# EAGLE design Ver.5 キッカー (EAGLE 9.6.2)

## Sheet 1 of 2
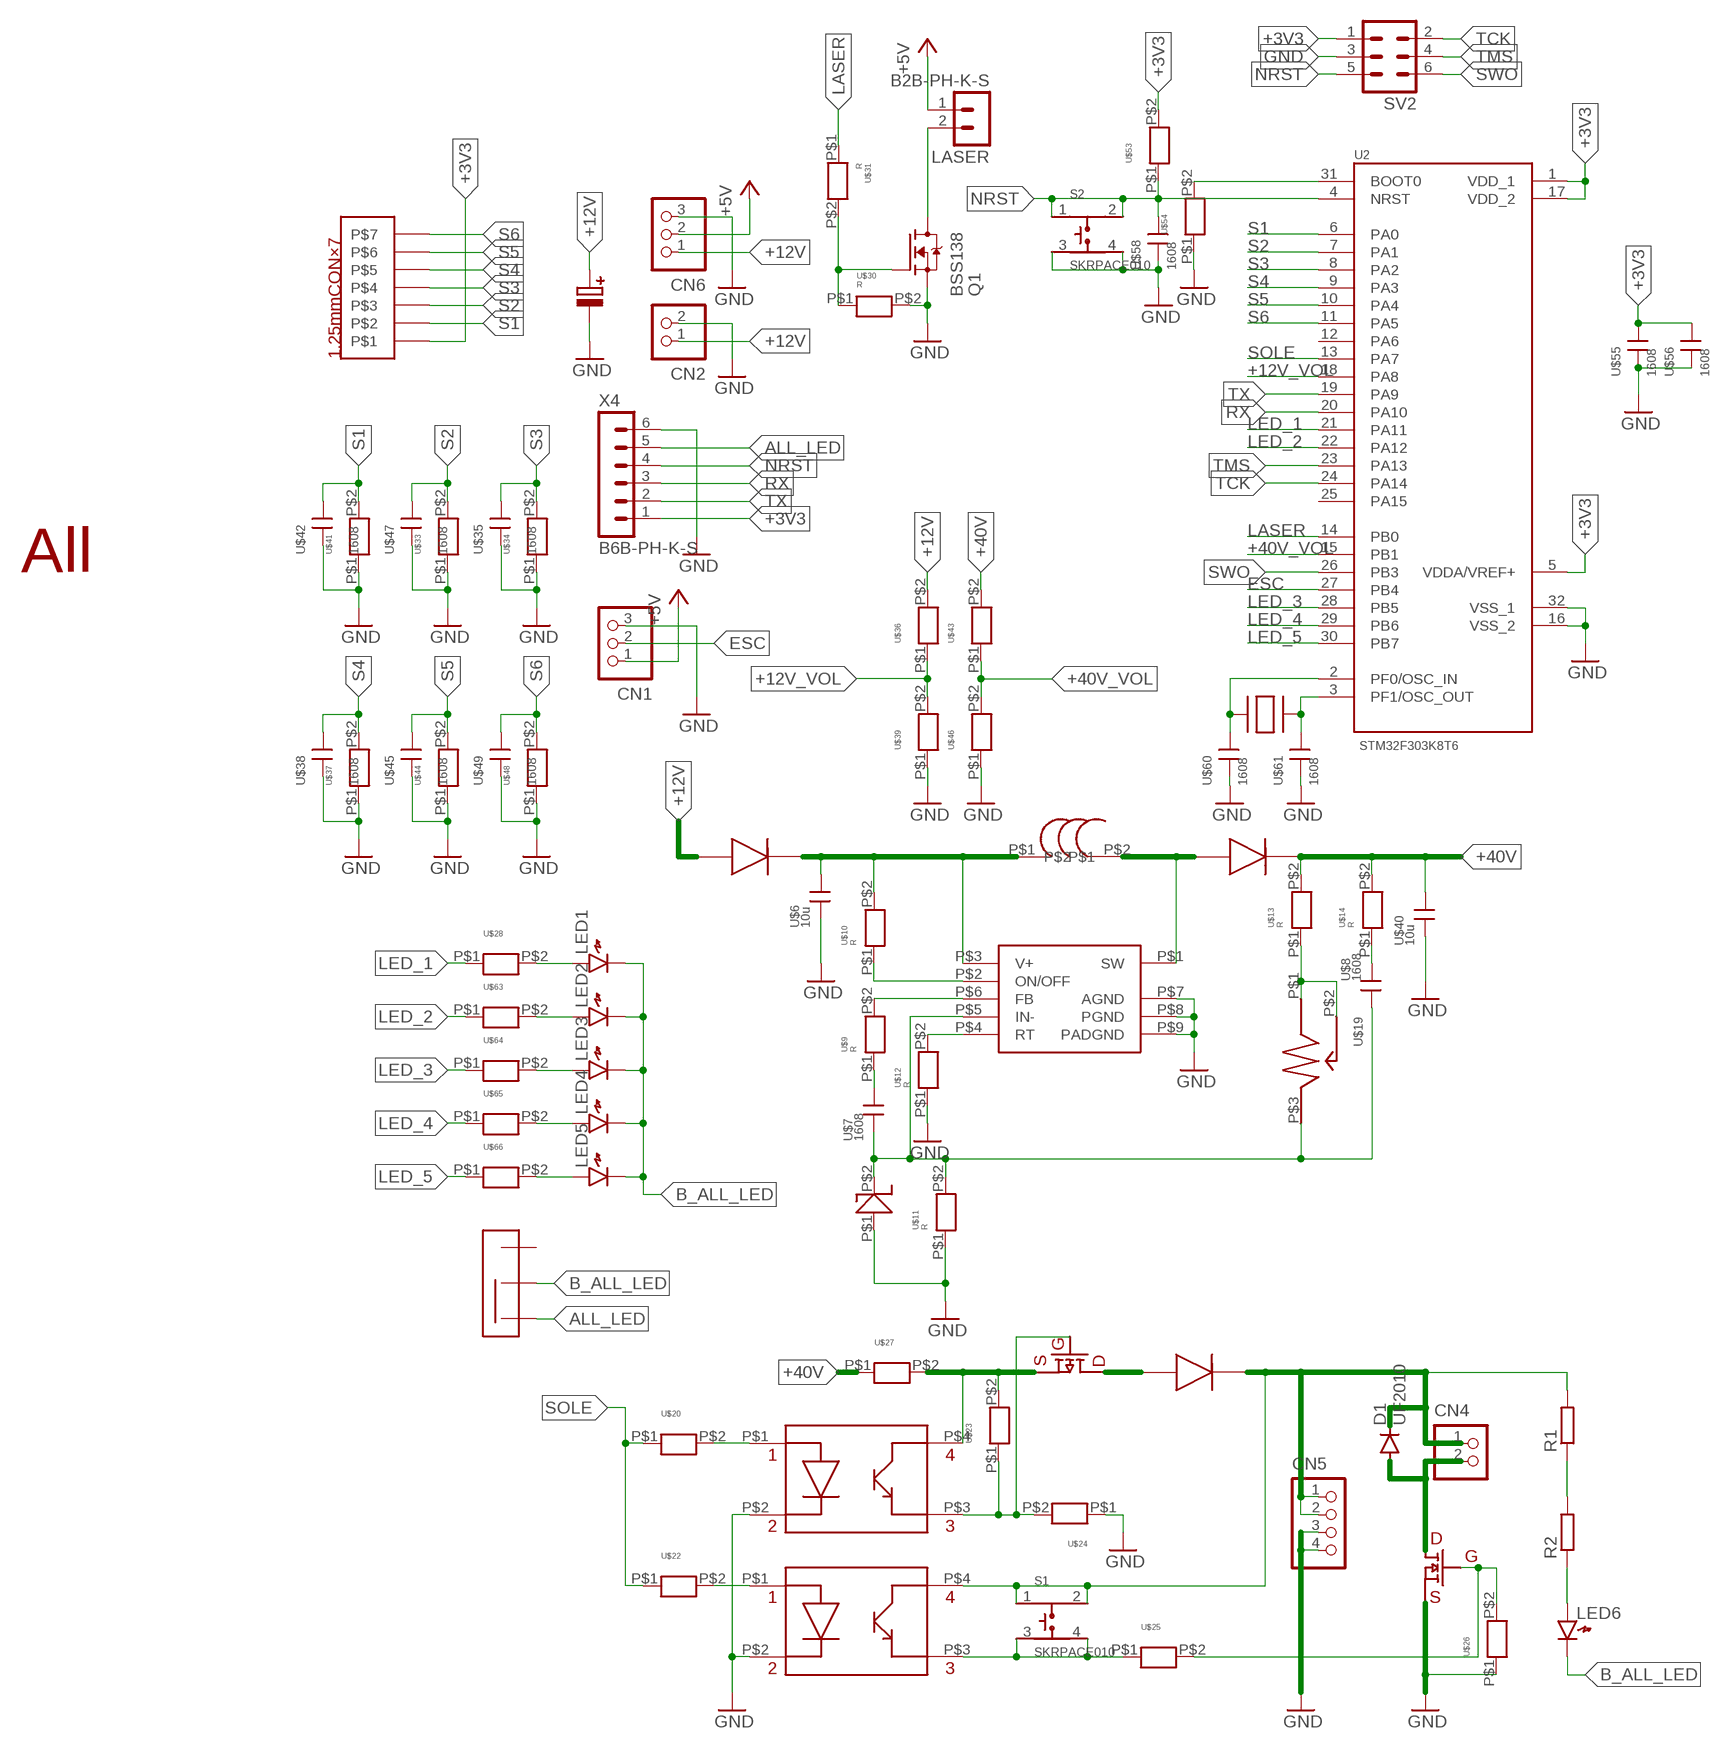
[diagram p0: schematic, sheet 1]

### Parts
CN1  B3B-XH-A  [B3B-XH-A]
CN2  B2B-XH-A  [B2B-XH-A]
CN4  B2B-XH-A  [B2B-XH-A]
CN5  B4B-XH-A  [B4B-XH-A]
CN6  B3B-XH-A  [B3B-XH-A]
D1  UF2010  1N4148DO35-10  [DO35-10]
LASER  B2B-PH-K-S  [B2B-PH-K-S]
LED1  LED1608  [LED1608]
LED2  LED1608  [LED1608]
LED3  LED1608  [LED1608]
LED4  LED1608  [LED1608]
LED5  LED1608  [LED1608]
LED6  LED1608  [LED1608]
Q1  BSS138  [SOT23]
R1  R-EU_0207/12  [0207/12]
R2  R-EU_0207/12  [0207/12]
S1  SKRPACE010  [SW_SKRPACE010]
S2  SKRPACE010  [SW_SKRPACE010]
SV2  ML6  [ML6]
U2  STM32F303K8T6  [QFP80P900X900X160-32N]
U$1  TD  [TD]
U$2  40V5A  [40V5A]
U$3  40V5A  [40V5A]
U$4  TLP291  [TPL291]
U$5  NJW4131GM1  [NJW4131]
U$6  10u  1608  [CON]
U$7  1608  [CON]
U$8  1608  [CON]
U$9  R  [1608]
U$10  R  [1608]
U$11  R  [1608]
U$12  R  [1608]
U$13  R  [1608]
U$14  R  [1608]
U$15  TLP291  [TPL291]
U$16  808  [808]
U$17  SSM6K8  [SSM6K8]
U$18  40V5A  [40V5A]
U$19  VR  [VR]
U$20  R  [1608]
U$21  1MM7  [1MM7]
U$22  R  [1608]
U$23  R  [1608]
U$24  R  [1608]
U$25  R  [1608]
U$26  R  [1608]
U$27  R  [1608]
U$28  R  [1608]
U$29  ALL  [ALL]
U$30  R  [1608]
U$31  R  [1608]
U$33  R  [1608]
U$34  R  [1608]
U$35  1608  [CON]
U$36  R  [1608]
U$37  R  [1608]
U$38  1608  [CON]
U$39  R  [1608]
U$40  10u  1608  [CON]
U$41  R  [1608]
U$42  1608  [CON]
U$43  R  [1608]
U$44  R  [1608]
U$45  1608  [CON]
U$46  R  [1608]
U$47  1608  [CON]
U$48  R  [1608]
U$49  1608  [CON]
U$50  I  [I]
U$53  R  [1608]
U$54  R  [1608]
U$55  1608  [CON]
U$56  1608  [CON]
U$58  1608  [CON]
U$59  SUISYOU  [水晶]
U$60  1608  [CON]
U$61  1608  [CON]
U$62  25V100  [25V100]
U$63  R  [1608]
U$64  R  [1608]
U$65  R  [1608]
U$66  R  [1608]
U$67  SSW  [SSW]
X4  B6B-PH-K-S  [B6B-PH-K-S]

### Nets
+3V3 [New Class]: SV2.1 U2.1(VDD_1) U2.5(VDDA/VREF+) U2.17(VDD_2) U$21.P$1 U$53.P$2 U$55.P$1 U$56.P$1 X4.1
+5V [New Class]: CN1.1 CN6.2 LASER.1
+12V [New Class]: CN2.1 CN6.1 U$3.P$1 U$36.P$2 U$62.P$1
+12V_VOL: U2.18(PA8) U$36.P$1 U$39.P$2
+40V [New Class]: U$2.P$2 U$13.P$2 U$14.P$2 U$27.P$1 U$40.P$1 U$43.P$2
+40V_VOL: U2.15(PB1) U$43.P$1 U$46.P$2
ALL_LED [New Class]: U$67.P$1 X4.5
B_ALL_LED [New Class]: LED1.K LED2.K LED3.K LED4.K LED5.K LED6.K U$67.P$3
ESC: CN1.2 U2.27(PB4)
GND [New Class]: CN1.3 CN2.2 CN5.3 CN5.4 CN6.3 Q1.2(S) S2.3 S2.4 SV2.3 U2.16(VSS_2) U2.32(VSS_1) U$1.P$1 U$4.P$2 U$5.P$7(AGND) U$5.P$8(PGND) U$5.P$9(PADGND) U$6.P$2 U$11.P$1 U$12.P$1 U$15.P$2 U$17.S U$24.P$1 U$26.P$1 U$30.P$2 U$33.P$1 U$34.P$1 U$35.P$2 U$37.P$1 U$38.P$2 U$39.P$1 U$40.P$2 U$41.P$1 U$42.P$2 U$44.P$1 U$45.P$2 U$46.P$1 U$47.P$2 U$48.P$1 U$49.P$2 U$54.P$1 U$55.P$2 U$56.P$2 U$58.P$2 U$60.P$2 U$61.P$2 U$62.P$2 X4.6
LASER: U2.14(PB0) U$31.P$1
LED_1: U2.21(PA11) U$28.P$1
LED_2: U2.22(PA12) U$63.P$1
LED_3: U2.28(PB5) U$64.P$1
LED_4: U2.29(PB6) U$65.P$1
LED_5: U2.30(PB7) U$66.P$1
N$1: U$4.P$1 U$20.P$2
N$2: U$5.P$2(ON/OFF) U$10.P$1
N$3: U$1.P$2 U$5.P$5(IN-) U$7.P$2 U$8.P$2 U$11.P$2 U$19.P$3
N$4: U$8.P$1 U$14.P$1
N$5: U$3.P$2 U$5.P$3(V+) U$6.P$1 U$10.P$2 U$50.P$1
N$6: U$2.P$1 U$5.P$1(SW) U$50.P$2
N$7: U$5.P$6(FB) U$9.P$2
N$8: U$7.P$1 U$9.P$1
N$9: U$15.P$1 U$22.P$2
N$11: U$5.P$4(RT) U$12.P$2
N$12: LED6.A R2.1
N$13: U$4.P$4 U$16.S U$23.P$2 U$27.P$2
N$14: U$4.P$3 U$16.G U$23.P$1 U$24.P$2
N$15: S1.3 S1.4 U$15.P$3 U$25.P$1
N$16: U$17.G U$25.P$2 U$26.P$2
N$17: R1.1 R2.2
N$18: CN4.2 D1.A U$17.D U$17.DD(D) U$17.DDD(D) U$17.DDDD(D)
N$19: CN4.1 CN5.1 CN5.2 D1.C R1.2 S1.1 S1.2 U$15.P$4 U$18.P$2
N$20: U$16.D U$16.DD(D) U$16.DDD(D) U$16.DDDD(D) U$18.P$1
N$21: LASER.2 Q1.3(D)
N$22: Q1.1(G) U$30.P$1 U$31.P$2
N$23: LED2.A U$63.P$2
N$24: U$13.P$1 U$19.P$1 U$19.P$2
N$25: LED1.A U$28.P$2
N$28: LED3.A U$64.P$2
N$30: LED4.A U$65.P$2
N$32: LED5.A U$66.P$2
N$46: U2.31(BOOT0) U$54.P$2
N$47: U2.2(PF0/OSC_IN) U$59.P$1 U$60.P$1
N$48: U2.3(PF1/OSC_OUT) U$59.P$2 U$61.P$1
NRST: S2.1 S2.2 SV2.5 U2.4(NRST) U$53.P$1 U$58.P$1 X4.4
RX: U2.20(PA10) X4.3
S1: U2.6(PA0) U$21.P$2 U$41.P$2 U$42.P$1
S2: U2.7(PA1) U$21.P$3 U$33.P$2 U$47.P$1
S3: U2.8(PA2) U$21.P$4 U$34.P$2 U$35.P$1
S4: U2.9(PA3) U$21.P$5 U$37.P$2 U$38.P$1
S5: U2.10(PA4) U$21.P$6 U$44.P$2 U$45.P$1
S6: U2.11(PA5) U$21.P$7 U$48.P$2 U$49.P$1
SOLE: U2.13(PA7) U$20.P$1 U$22.P$1
SWO: SV2.6 U2.26(PB3)
TCK: SV2.2 U2.24(PA14)
TMS: SV2.4 U2.23(PA13)
TX: U2.19(PA9) X4.2
Unconnected: U2.12(PA6) U2.25(PA15) U$67.P$2

## Sheet 2 of 2
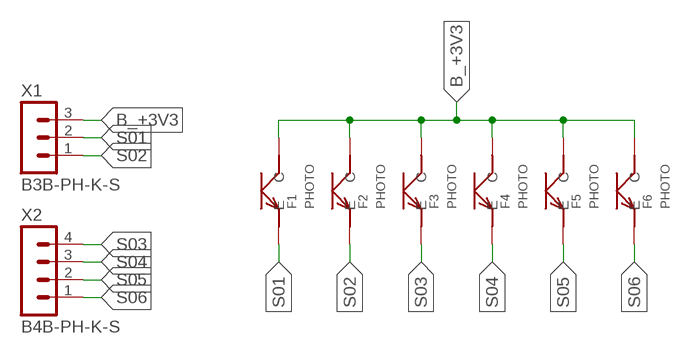
[diagram p1: schematic, sheet 2]

### Parts
F1  PHOTO  [PHOTO]
F2  PHOTO  [PHOTO]
F3  PHOTO  [PHOTO]
F4  PHOTO  [PHOTO]
F5  PHOTO  [PHOTO]
F6  PHOTO  [PHOTO]
X1  B3B-PH-K-S  [B3B-PH-K-S]
X2  B4B-PH-K-S  [B4B-PH-K-S]

### Nets
B_+3V3 [New Class]: F1.P$1(C) F2.P$1(C) F3.P$1(C) F4.P$1(C) F5.P$1(C) F6.P$1(C) X1.3
S01: F1.P$2(E) X1.2
S02: F2.P$2(E) X1.1
S03: F3.P$2(E) X2.4
S04: F4.P$2(E) X2.3
S05: F5.P$2(E) X2.2
S06: F6.P$2(E) X2.1

## Library data of the parts
CN1 CN6 = jst-xh:B3B-XH-A: Wire-to-Board 2.5mm pitch top mount connector Source: http://www.jst-mfg.com/product/pdf/jpn/XH.pdf http://www.jst-mfg.com/product/detail.php?series=277
CN2 CN4 = jst-xh:B2B-XH-A: Wire-to-Board 2.5mm pitch top mount connector Source: http://www.jst-mfg.com/product/pdf/jpn/XH.pdf http://www.jst-mfg.com/product/detail.php?series=277
CN5 = jst-xh:B4B-XH-A: Wire-to-Board 2.5mm pitch top mount connector Source: http://www.jst-mfg.com/product/pdf/jpn/XH.pdf http://www.jst-mfg.com/product/detail.php?series=277
D1 = diode:1N4148: DIODE high speed (Philips)
F1-F6 = Chip phototransistor:PHOTO
LASER = con-JST PH:B2B-PH: JST PH series header 2.00mm pitch disconnectable crimp style connectors, vertical (side entry type), 2 pins
LED1-LED6 = generic:LED: Generic LEDs
Q1 = bss138_10:BSS138: BSS138 N-Channel Logic Level Enhancement Mode Field Effect Transistor Source: http://www.fairchildsemi.com/datasheets/BS/BSS138.pdf; MF: Fairchild; MPN: BSS138; OC_FARNELL: 9845330; OC_NEWARK: 67R2009
R1 R2 = rcl:R-EU_: RESISTOR, European symbol; SPICEPREFIX: R
S1 S2 = SKRPACE010:SKRPACE010: Switch Tactile N.O. SPST Button J-Bend 0.05A 16VDC 2.55N SMD Automotive T/R Check prices <https://pricing.snapeda.com/parts/SKRPACE010/ALPS/view-part?ref=eda>; AVAILABILITY: In Stock; DESCRIPTION: Switch Tactile N.O. SPST Button J-Bend 0.05A 16VDC 2.55N SMD Automotive T/R; MF: ALPS; MP: SKRPACE010; PACKAGE: None; PRICE: None
SV2 = con-ml:ML6: HARTING; OC_FARNELL: unknown; OC_NEWARK: unknown
U2 = STM32F303K8T6:STM32F303K8T6: Analog and DSP with FPU ARM Cortex-M4 MCU with 64 Kbytes Flash, 72 MHz CPU, CCM, 12-bit ADC 5 MSPS, comparators, op-amp Check availability <https://pricing.snapeda.com/parts/STM32F303K8T6/STMicroelectronics/view-part?ref=eda>; AVAILABILITY: In Stock; DESCRIPTION: ARM® Cortex®-M4 STM32F3 Microcontroller IC 32-Bit 72MHz 64KB (64K x 8) FLASH 32-LQFP (7x7); MF: STMicroelectronics; MP: STM32F303K8T6; PACKAGE: LQFP-32 STMicroelectronics; PRICE: None; PURCHASE-URL: https://pricing.snapeda.com/search/part/STM32F303K8T6/?ref=eda
U$1 = ZD 3.9V200mW:TD
U$2 U$3 U$18 = D40V5A:40V5A
U$4 U$15 = TLP291:TLP291
U$5 = NJW4131GM1:NJW4131GM1
U$6-U$8 U$35 U$38 U$40 U$42 U$45 U$47 U$49 U$55 U$56 U$58 U$60 U$61 = con1608:1608
U$9-U$14 U$20 U$22-U$28 U$30 U$31 U$33 U$34 U$36 U$37 U$39 U$41 U$43 U$44 U$46 U$48 U$53 U$54 U$63-U$66 = R 1608:R
U$16 = PchMOSFET SSM6J808R:808
U$17 = NchMOSFET SSM6K819R:SSM6K8
U$19 = VR tippu:VR
U$21 = 7P_1.25mmCON:1MM7
U$29 = All_outlook:ALL
U$50 = Inductor_Read:I
U$59 = 水晶:SUISYOU
U$62 = 100uF25V 電解:25V100
U$67 = SSW:SSW
X1 = con-JST PH:B3B-PH: JST PH series header 2.00mm pitch disconnectable crimp style connectors, vertical (side entry type), 3 pins
X2 = con-JST PH:B4B-PH: JST PH series header 2.00mm pitch disconnectable crimp style connectors, vertical (side entry type), 4 pins
X4 = con-JST PH:B6B-PH: JST PH series header 2.00mm pitch disconnectable crimp style connectors, vertical (side entry type), 6 pins

## Net classes
1 New Class: width 0.254 mm

## Board
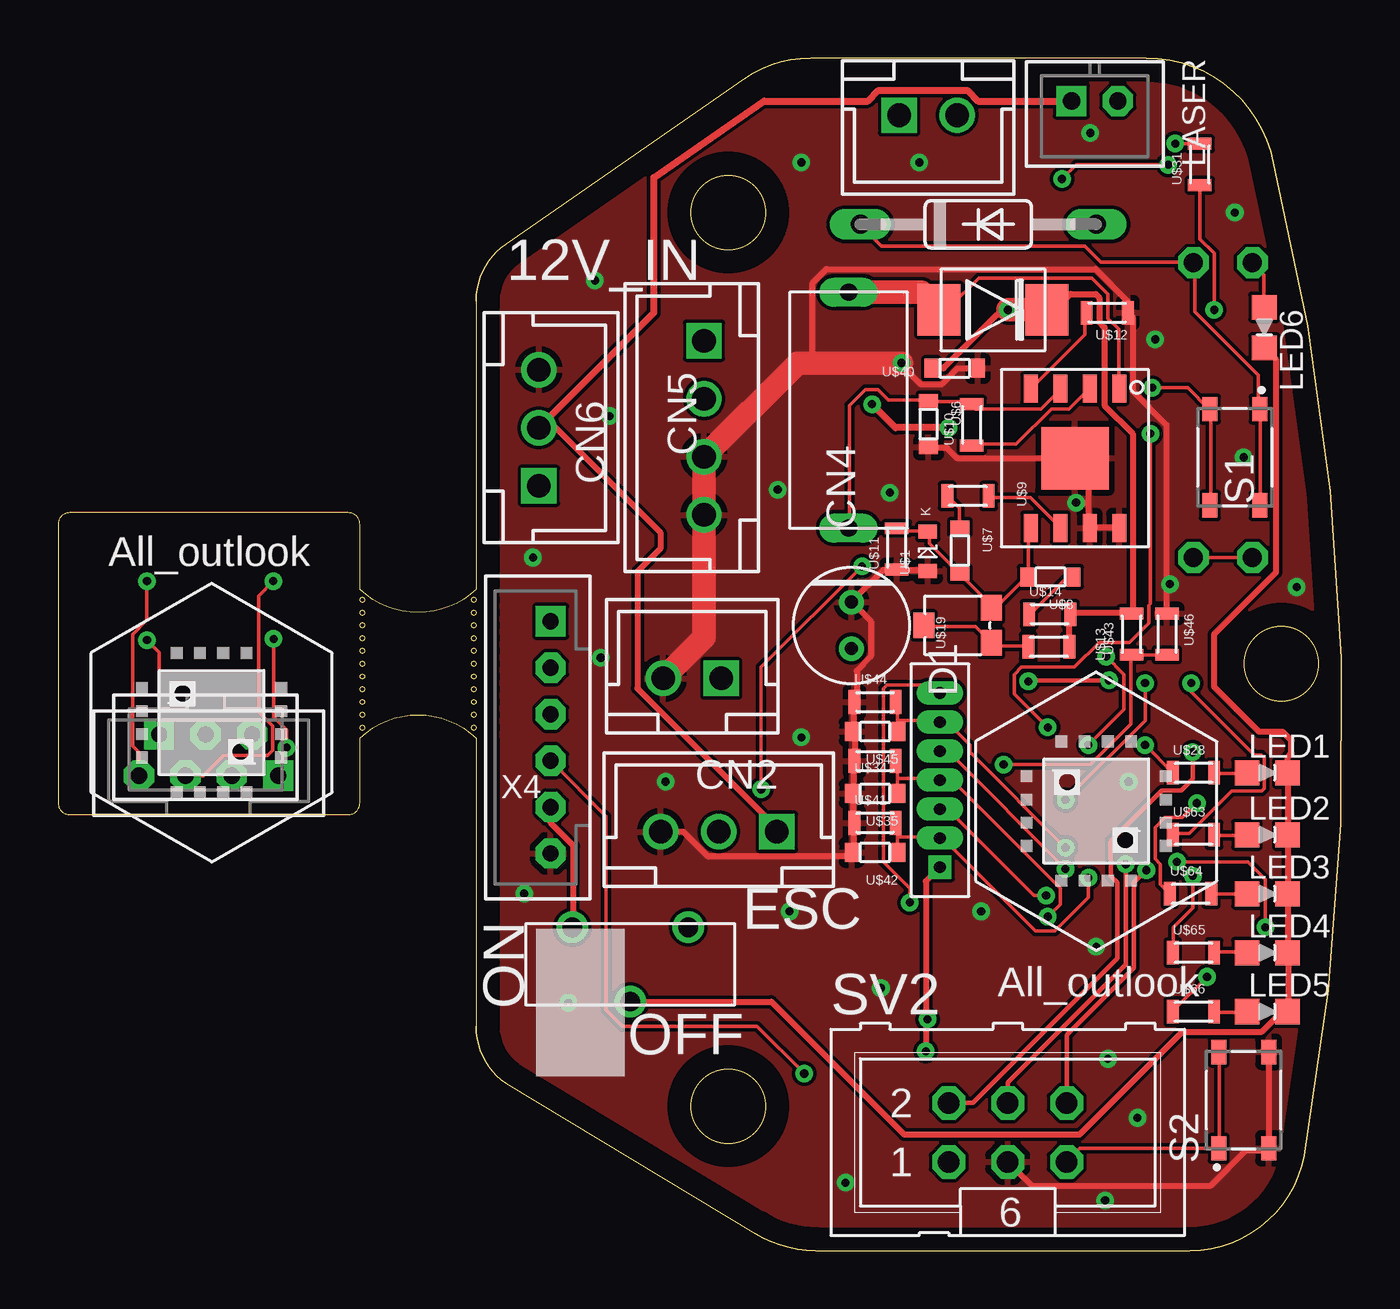
[diagram p2: board, top side]
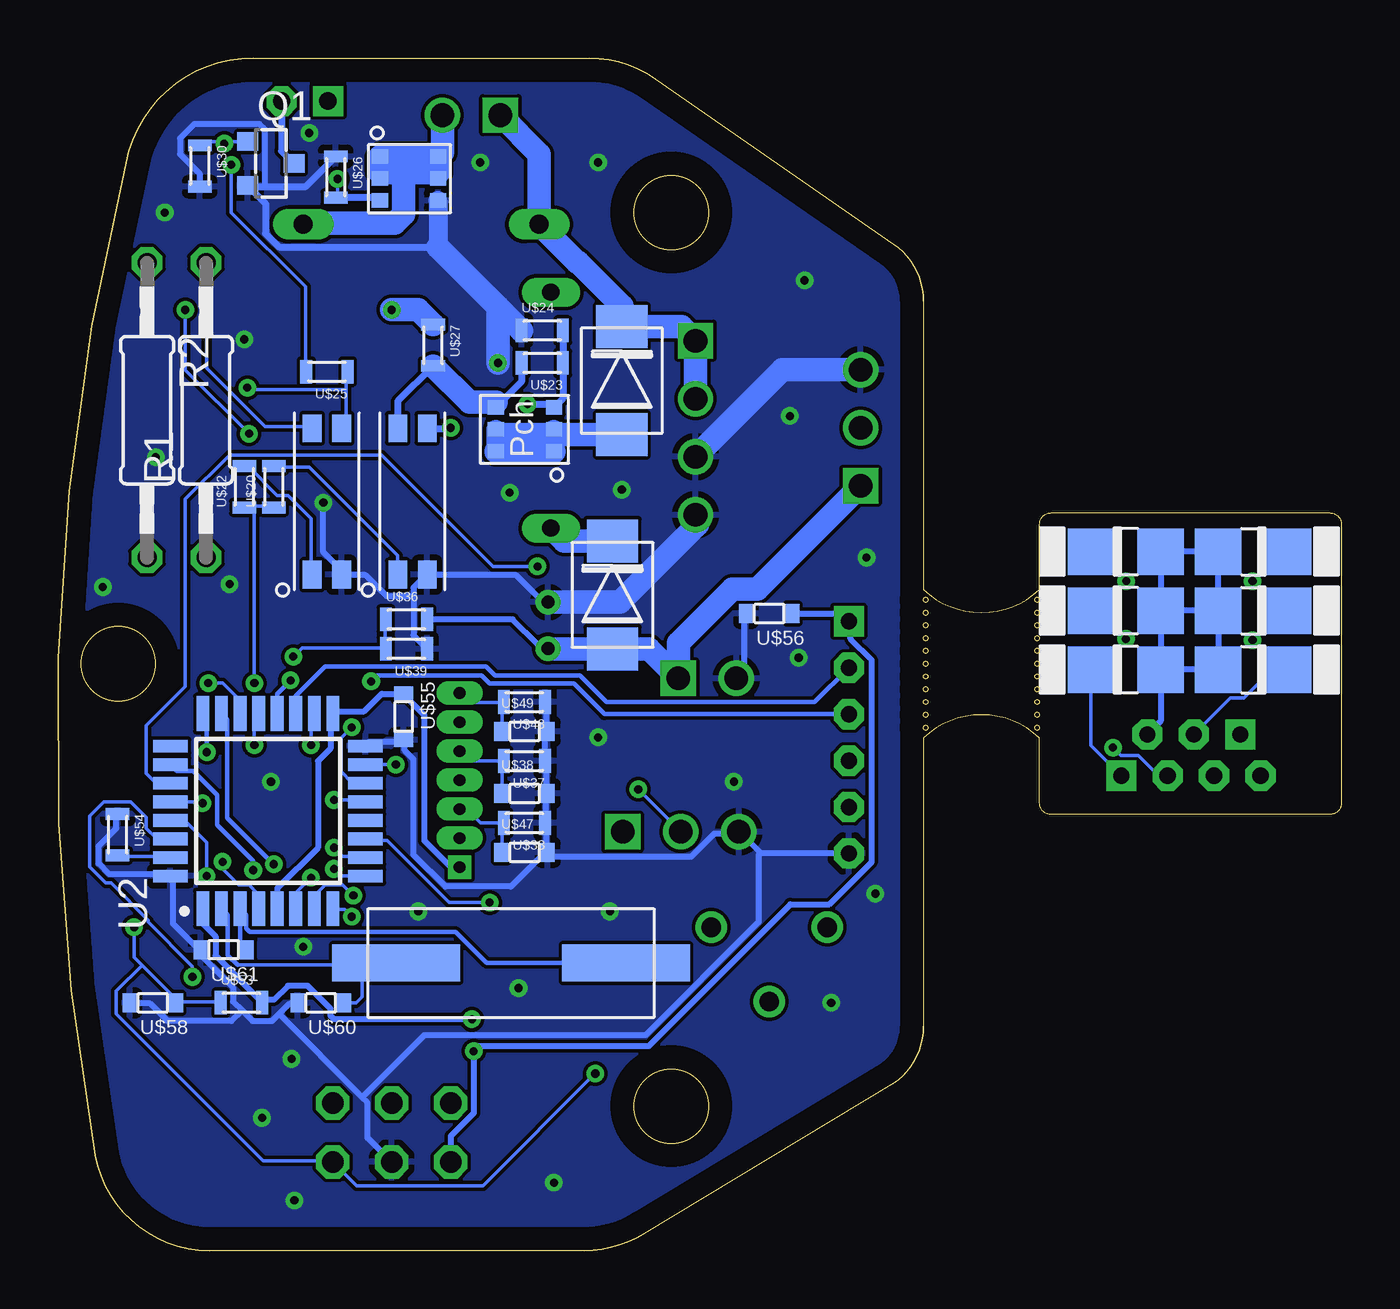
[diagram p3: board, bottom side, seen from below]

Size 55.27 x 51.36 mm. Coordinates in mm from the lower left corner, seen from the top.
Outline: 29.57,50.47 arc-35 32.41,51.36
Outline: 46.86,51.36 arc-79 52.34,46.85
Outline: 52.34,46.85 arc-24 53.67,4.1
Outline: 53.67,4.1 arc-80 48.75,0
Outline: 32.63,0 arc-31 30.04,0.72
Outline: 19.29,7.19 arc-55 18,9.66
Outline: 18,40.89 arc-55 19.29,43.35
Outline: 29.57,50.47 19.29,43.35
Outline: 19.29,43.35 arc55 18,40.89
Outline: 18,40.89 18,28.47 arc-87 13,28.47 13,31.27 arc90 12.5,31.77 0.5,31.77 arc90 0,31.27 0,19.27 arc90 0.5,18.77 12.5,18.77 arc90 13,19.27 13,22.07 arc-87 18,22.07 18,9.66
Outline: 18,9.66 arc55 19.29,7.19
Outline: 19.29,7.19 30.04,0.72
Outline: 30.04,0.72 arc31 32.63,0
Outline: 32.63,0 48.75,0
Outline: 48.75,0 arc80 53.67,4.1
Outline: 53.67,4.1 arc24 52.34,46.85
Outline: 52.34,46.85 arc79 46.86,51.36
Outline: 46.86,51.36 32.41,51.36
Outline: 32.41,51.36 arc35 29.57,50.47
Outline: circle at 28.86,6.22 radius 1.6
Outline: circle at 28.86,44.71 radius 1.6
Outline: circle at 52.68,25.27 radius 1.6
Outline: circle at 28.86,44.71 radius 1.6
Outline: circle at 52.68,25.27 radius 1.6
Outline: circle at 28.86,6.22 radius 1.6
Outline: circle at 13.1,25.27 radius 0.1
Outline: circle at 13.1,22.52 radius 0.1
Outline: circle at 13.1,23.07 radius 0.1
Outline: circle at 13.1,23.62 radius 0.1
Outline: circle at 13.1,24.17 radius 0.1
Outline: circle at 13.1,24.72 radius 0.1
Outline: circle at 13.1,25.82 radius 0.1
Outline: circle at 13.1,26.37 radius 0.1
Outline: circle at 13.1,26.92 radius 0.1
Outline: circle at 13.1,27.47 radius 0.1
Outline: circle at 13.1,28.02 radius 0.1
Outline: circle at 17.9,25.82 radius 0.1
Outline: circle at 17.9,23.62 radius 0.1
Outline: circle at 17.9,24.17 radius 0.1
Copper layers (1*16): Top 0.035mm / dielectric 1.5mm / Bottom 0.035mm
Design rules "default": minimum track width 6mil, minimum drill 0.35mm, track to track 6mil, track to pad 6mil, pad to pad 6mil, via to via 6mil, smd to smd 6mil, copper to edge 40mil, drill to drill 6mil, minimum pad ring 10mil, minimum via ring 8mil, stop-mask expansion 4mil, vias tented up to drill 0mil, thermal gap 10mil

### Footprints (pad centres in the part's own frame; a part is rotated, then mirrored left to right if it is on the bottom)
B3B-XH-A = drill 1.016 square: 1 -2.5,0 | drill 1.016: 2 0,0; 3 2.5,0
B2B-XH-A = drill 1.016 square: 1 -1.25,0 | drill 1.016: 2 1.25,0
B4B-XH-A = drill 1.016 square: 1 -3.75,0 | drill 1.016: 2 -1.25,0; 3 1.25,0; 4 3.75,0
DO35-10 = drill 0.813 long: A 5.08,0; C -5.08,0
PHOTO = smd 2 x 2 bottom: P$1 -1.365,0; P$2 1.635,0
B2B-PH-K-S = drill 0.75 pad 1.3 square: 1 1,0 | drill 0.75 pad 1.3 octagon: 2 -1,0
LED1608 = smd 1.05 x 1.08: A -0.875,0; K 0.875,0
SOT23 = smd 0.8 x 0.9: 1 -0.95,-1; 2 0.95,-1; 3 0,1
0207/12 = drill 0.813 octagon: 1 -6.35,0; 2 6.35,0
SW_SKRPACE010 = smd 1.05 x 0.65: 1 -2.075,1.075; 2 2.075,1.075; 3 -2.075,-1.075; 4 2.075,-1.075
ML6 = drill 0.914 octagon: 1 -2.54,-1.27; 2 -2.54,1.27; 3 0,-1.27; 4 0,1.27; 5 2.54,-1.27; 6 2.54,1.27
QFP80P900X900X160-32N = smd 1.5 x 0.55: 1 -4.2,2.8; 2 -4.2,2; 3 -4.2,1.2; 4 -4.2,0.4; 5 -4.2,-0.4; 6 -4.2,-1.2; 7 -4.2,-2; 8 -4.2,-2.8; 17 4.2,-2.8; 18 4.2,-2; 19 4.2,-1.2; 20 4.2,-0.4; 21 4.2,0.4; 22 4.2,1.2; 23 4.2,2; 24 4.2,2.8 | smd 0.55 x 1.5: 9 -2.8,-4.2; 10 -2,-4.2; 11 -1.2,-4.2; 12 -0.4,-4.2; 13 0.4,-4.2; 14 1.2,-4.2; 15 2,-4.2; 16 2.8,-4.2; 25 2.8,4.2; 26 2,4.2; 27 1.2,4.2; 28 0.4,4.2; 29 -0.4,4.2; 30 -1.2,4.2; 31 -2,4.2; 32 -2.8,4.2
TD = smd 0.6 x 0.8: P$1 -0.85,0; P$2 0.85,0
40V5A = smd 1.85 x 2.2: P$1 -2.325,0; P$2 2.325,0
TPL291 = smd 1.2 x 0.8: P$1 -3.15,1.27; P$2 -3.15,0; P$3 3.15,0; P$4 3.15,1.27
NJW4131 = smd 1.2 x 0.6: P$1 -3,2.54; P$2 -3,1.27; P$3 -3,0; P$4 -3,-1.27; P$5 3,-1.27; P$6 3,0; P$7 3,1.27; P$8 3,2.54 | smd 2.7 x 2.9: P$9 0,0.635
CON = smd 0.6 x 0.813: P$1 -1,0; P$2 1,0
1608 = smd 0.508 x 1.016: P$1 -0.889,0; P$2 0.889,0
808 = smd 0.62 x 0.7: D 0,0; DD 0.95,0; DDD 0.95,2.5; DDDD 0,2.5; G 1.9,0; S 1.9,2.5
SSM6K8 = smd 0.62 x 0.7: D 0,0; DD 0.95,0; DDD 0.95,2.5; DDDD 0,2.5; G 1.9,0; S 1.9,2.5
VR = smd 1.1 x 0.9: P$1 0,1.45; P$2 -0.75,-1.45; P$3 0.75,-1.45
1MM7 = drill 0.5 square: P$1 0,0 | drill 0.5 long: P$2 1.25,0; P$3 2.5,0; P$4 3.75,0; P$5 5,0; P$6 6.25,0; P$7 7.5,0
I = drill 0.75 long: P$1 0,0; P$2 10.16,0
水晶 = smd 5.5 x 1.6: P$1 1.2,2.35; P$2 11.1,2.35
25V100 = drill 0.55: P$1 -1,0; P$2 1,0
SSW = drill 0.85: P$1 -2.5,1.6; P$2 2.5,1.6; P$3 0,-1.6
B3B-PH-K-S = drill 0.7 pad 1.3 square: 1 2,0 | drill 0.7 pad 1.3 octagon: 2 0,0; 3 -2,0
B4B-PH-K-S = drill 0.7 pad 1.3 square: 1 3,0 | drill 0.7 pad 1.3 octagon: 2 1,0; 3 -1,0; 4 -3,0
B6B-PH-K-S = drill 0.7 pad 1.3 square: 1 5,0 | drill 0.7 pad 1.3 octagon: 2 3,0; 3 1,0; 4 -1,0; 5 -3,0; 6 -5,0

### Placement (x,y rotation side)
CN1  28.45,18.03 180 top
CN2  27.31,24.64 180 top
CN4  37.47,48.9 0 top
CN5  27.82,35.43 270 top
CN6  20.71,35.43 90 top
D1  39.63,44.2 0 top
F1  3.94,25.02 180 top
F2  3.94,27.56 180 top
F3  3.94,30.1 180 top
F4  9.15,30.1 0 top
F5  9.15,27.56 0 top
F6  9.15,25.02 0 top
LASER  44.64,49.5 180 top
LED1  52.08,20.57 0 top
LED2  52.08,17.91 0 top
LED3  52.08,15.37 0 top
LED4  52.08,12.83 0 top
LED5  52.08,10.29 0 top
LED6  51.95,39.75 270 top
Q1  46.11,46.81 270 bottom
R1  48.9,36.2 90 bottom
R2  51.44,36.2 270 bottom
S1  50.68,34.16 270 top
S2  51.06,6.48 90 top
SV2  40.9,5.08 0 top
U2  46.23,18.92 90 bottom
U$1  37.46,30.11 90 top
U$2  40.27,40.51 0 top
U$3  31.39,28.23 90 bottom
U$4  39.38,32.26 90 bottom
U$5  43.16,34.12 270 top
U$6  37.49,35.59 270 top
U$7  38.84,30.15 270 top
U$8  42.74,29.01 180 top
U$9  39.19,32.5 0 top
U$10  39.35,35.56 90 top
U$11  36.12,30.22 90 top
U$12  45.18,40.39 180 top
U$13  42.67,26 0 top
U$14  42.71,27.4 0 top
U$15  43.06,32.26 90 bottom
U$16  33.91,34.42 90 bottom
U$17  41.41,47.12 270 bottom
U$18  30.99,37.47 90 bottom
U$19  38.74,26.92 90 top
U$20  45.98,32.89 90 bottom
U$21  37.98,16.51 90 top
U$22  47.25,32.89 90 bottom
U$23  34.42,38.23 180 bottom
U$24  34.42,39.62 0 bottom
U$25  43.69,37.85 180 bottom
U$26  43.31,46.23 270 bottom
U$27  39.12,38.99 270 bottom
U$28  48.9,20.57 0 top
U$29  44.71,18.92 0 top
U$30  49.17,46.71 270 bottom
U$31  49.17,46.77 90 top
U$32  ALL  [ALL]  6.61,22.73 180 top
U$33  35.19,18.42 180 bottom
U$34  35.19,21.08 0 top
U$35  35.19,19.69 180 top
U$36  40.27,27.18 0 bottom
U$37  35.19,21.08 180 bottom
U$38  35.19,19.69 0 bottom
U$39  40.27,25.91 180 bottom
U$40  38.61,38 0 top
U$41  35.19,18.42 0 top
U$42  35.19,17.15 180 top
U$43  46.23,26.54 90 top
U$44  35.19,23.62 0 top
U$45  35.19,22.35 180 top
U$46  47.76,26.54 270 top
U$47  35.19,17.15 0 bottom
U$48  35.19,23.62 180 bottom
U$49  35.19,22.35 0 bottom
U$50  34.04,31.12 90 top
U$53  47.38,10.67 0 bottom
U$54  52.71,17.91 270 bottom
U$55  40.39,22.99 270 bottom
U$56  24.64,27.43 180 bottom
U$58  51.19,10.67 180 bottom
U$59  41.92,10.03 0 bottom
U$60  43.95,10.67 180 bottom
U$61  48.14,12.95 180 bottom
U$62  34.17,26.92 90 top
U$63  48.9,17.91 0 top
U$64  48.77,15.37 0 top
U$65  48.9,12.83 0 top
U$66  48.9,10.29 0 top
U$67  24.64,12.32 0 top
X1  6.36,22.23 180 top
X2  6.48,20.45 0 top
X4  21.21,22.1 90 top

### Tracks (layer width: path | path; a pad name or v marks a point on that pad's centre or on a via)
+3V3  (via drill 0.35)
  Top 0.254: 37.37,9.96 37.37,15.9 U$21.P$1 | 37.37,9.96 v37.37,8.59 | v37.45,9.96 37.37,9.96
  Bottom 0.254: U2.1 49.03,14.68 49.03,14.07 48.49,13.54 48.49,12.7 46.51,10.72 U$53.P$2 46.44,10.8 45.98,10.8 45.37,11.41 44.53,11.41 43.54,10.41 43.54,10.11 43.39,9.96 v37.45,9.96 | U$56.P$1 23.58,27.41 21.52,27.41 X4.1 21.14,27.03 21.14,26.34 20.22,25.43 20.22,16.74 22.05,14.91 23.73,14.91 29.83,8.81 37.14,8.81 v37.37,8.59 37.37,5.92 38.36,4.93 SV2.1 | U2.5 45.83,14.76 45.83,15.6 44.08,17.35 44.08,21.08 43.54,21.62 43.54,23.06 U2.17 43.39,23.14 43.31,23.22 42.09,23.22 41.33,23.98 40.42,23.98 U$55.P$1 40.34,23.9 39.5,23.06 39.5,17.65 38.36,16.51 U$21.P$1
+5V
  Top 0.254: CN1.1 30.89,18.03 30.89,18.26 24.95,24.21 24.95,29.24 25.94,30.23 25.94,30.91 21.14,35.71 CN6.2
  Top 0.305: CN6.2 25.66,40.39 25.66,46.21 30.41,49.5 34.87,49.5 35.33,49.96 39.16,49.96 39.62,49.5 LASER.1
+12V
  Bottom 0.254: U$36.P$2 35.69,27.18 34.63,26.11 U$62.P$1
  Bottom 1.016: CN6.1 25.14,28.5 26.22,28.5 28.56,26.16 CN2.1 29.83,25.91 U$3.P$1 34.15,25.91 U$62.P$1
+12V_VOL  (via drill 0.35)
  Top 0.152: v45.14,25.58 45.9,24.82 45.9,23.29 v44.38,21.77
  Bottom 0.152: U$36.P$1 41.18,27.18 41.18,25.96 U$39.P$2 41.26,25.96 44.76,25.96 v45.14,25.58 | v44.38,21.77 44.38,22.99 44.3,23.06 U2.18
+40V  (via drill 0.35)
  Top 0.254: U$13.P$2 43.54,26.04 43.54,27.33 U$14.P$2 43.69,27.48 46.21,27.48 U$43.P$2 46.28,27.56 46.28,35.18 45.07,36.4 45.07,39.75 44.84,39.98 44.84,41.05 44.69,41.2 43.62,41.2 43.08,40.67 U$2.P$2 | U$40.P$1 38.13,38 40.42,40.28 v40.9,40.51
  Top 1.016: v40.9,40.51 U$2.P$2
  Bottom 1.016: U$27.P$1 39.76,40.51 v40.9,40.51
+40V_VOL  (via drill 0.35)
  Top 0.152: U$46.P$2 U$43.P$1 46.21,25.65 46.21,22.68 44.46,20.93 v40.72,20.93
  Bottom 0.152: v40.72,20.93 42.02,20.93 U2.15
ALL_LED
  Top 0.254: X4.5 21.21,18.42 22.21,17.42 22.21,13.92 U$67.P$1
B_+3V3
  Bottom 0.254: F3.P$1 5.34,30.1 | 5.34,30.1 F4.P$1 F5.P$1 | F2.P$1 5.31,30.07 5.34,30.1 | F2.P$1 F5.P$1 | F2.P$1 F1.P$1 F6.P$1 | F5.P$1 F6.P$1 | F6.P$1 7.79,22.8 X1.3
B_ALL_LED
  Top 0.254: 51.92,38.91 LED6.K 52.46,38.37 52.46,29.21 49.79,26.54 49.79,24.28 50.69,23.38 50.73,23.33 50.79,23.28 51.72,22.35 52.73,22.35 53.12,21.96 53.12,21.42 52.95,21.26 LED1.K 52.99,20.55 52.99,17.96 LED2.K 52.99,17.88 52.99,15.44 LED3.K 52.99,15.37 52.99,12.93 LED4.K 52.99,12.78 52.99,10.34 LED5.K 52.84,10.26 52.69,10.26 51.85,9.42 48.42,9.42 44,5 36.43,5 30.71,10.72 U$67.P$3 | U$67.P$3
ESC  (via drill 0.35)
  Top 0.152: v34.63,29.46 30.28,25.12 v30.28,19.86
  Bottom 0.152: v34.63,29.46 36.53,29.46 41.33,34.27 47.88,34.27 49.79,32.36 49.79,24.28 51.47,22.61 51.47,20.55 51.09,20.17 50.48,20.17 U2.27 | CN1.2 v30.28,19.86
GND  (via drill 0.35)
  Top 0.254: S2.4 52.15,8.51 52.15,4.47 S2.3 52.08,4.32 51.16,4.32 49.64,2.79 41.94,2.79 40.95,3.79 SV2.3 | U$46.P$1 47.73,27.48 47.73,35.56 46.28,37.01 46.28,40.21 46.13,40.36 U$12.P$1 46.06,40.51 46.06,40.89 44.69,42.27 33.1,42.27 32.49,41.66 32.49,38.23 | U$5.P$8 45.67,31.14 44.46,31.14 U$5.P$7 44.38,31.22 44.38,32.21 | U$6.P$2 37.52,34.57 38.28,34.57 38.74,34.11 43.77,34.11 U$5.P$9 43.85,34.04 44.38,33.5 44.38,32.21 | U$1.P$1 37.45,29.31 36.15,29.31 U$11.P$1 36,29.31 35.54,29.31 34.17,27.94 U$62.P$2 34.25,27.86 35.01,27.1 35.01,25.58 34.4,24.97 34.4,23.67 U$48.P$1 34.25,23.6 34.25,22.38 U$49.P$2 34.32,22.3 34.32,21.08 U$37.P$1 34.25,21.01 34.25,19.79 U$38.P$2 34.25,19.63 34.25,18.49 U$41.P$1 34.25,18.42 34.25,17.2 U$42.P$2 34.09,17.12 33.94,16.97 28,16.97 26.93,18.03 CN1.3 | U$40.P$2 38.74,38 38.05,37.31 37.14,37.31 36.61,37.85 v36.33,38.23 | v43.85,32.21 44.38,32.21
  Top 1.016: CN2.2 27.82,26.4 CN5.4 CN5.3 31.86,38.23 32.49,38.23 v36.33,38.23
  Bottom 0.254: U$54.P$1 52.76,18.8 52.76,18.19 53.52,17.42 53.52,16.66 53.07,16.21 50.55,16.21 50.48,16.13 U2.32 50.32,16.05 50.32,14.07 49.26,13.01 U$61.P$2 49.1,12.93 49.1,12.7 47.73,11.33 47.73,10.72 47.35,10.34 | 45.75,10.19 46.06,9.88 46.89,9.88 47.35,10.34 | 45.75,10.19 45.29,10.64 44.99,10.64 U$60.P$2 | 47.35,10.34 47.81,9.88 50.55,9.88 51.31,10.64 52.15,10.64 U$58.P$2 | 42.17,6.6 41.94,6.38 41.94,4.85 SV2.3 | 42.17,6.6 45.75,10.19 | 25.02,17.12 21.21,17.12 X4.6 | 25.02,17.12 CN1.3 26.02,17.96 27.01,17.96 28,16.97 33.94,16.97 34.09,17.12 U$42.P$2 | U2.16 42.02,21.77 41.86,21.92 40.42,21.92 U$55.P$2 40.34,21.84 40.34,21.54 39.96,21.16 39.96,17.04 38.59,15.67 35.77,15.67 34.32,17.12 U$42.P$2 | U$42.P$2 34.25,17.2 34.25,18.42 U$41.P$1 34.25,18.49 34.25,19.63 U$38.P$2 34.25,19.79 34.25,21.01 U$37.P$1 34.32,21.08 34.32,22.3 U$49.P$2 34.25,22.38 34.25,23.6 U$48.P$1 | 42.17,6.6 39.5,9.27 29.98,9.27 25.1,14.15 25.1,17.04 25.02,17.12 | U$39.P$1 39.96,26.49 39.96,28.17 | 39.96,28.17 39.96,28.55 39.43,29.08 U$4.P$2 39.27,29.08 35.54,29.08 34.63,28.17 U$62.P$2 | 39.96,28.17 41.1,28.17 42.02,29.08 43.01,29.08 U$15.P$2 43.16,29.16 43.16,29.39 43.85,30.07 v43.85,32.21 | U$56.P$2 25.71,27.41 25.71,24.97 26.02,24.66 CN2.2 | 46.36,45.8 46.36,48.29 46.59,48.51 49.41,48.51 50.02,47.9 50.02,47.22 49.18,46.38 49.18,45.85 U$30.P$2
  Bottom 0.305: Q1.2 47.04,45.8 | 47.04,45.8 46.34,45.09 46.34,43.8 45.76,43.22 38.91,43.22 | U$26.P$1 44.63,45.8 46.36,45.8 47.04,45.8
  Bottom 0.813: U$17.S 38.91,43.22
  Bottom 1.016: 38.91,43.22 36.33,40.64 | 36.33,40.64 U$24.P$1 | CN6.3 24.07,37.93 CN5.3 | CN5.4 27.73,31.59 27.73,31.26 31.07,27.92 U$62.P$2 | v36.33,38.23 36.33,40.64
  other vias: 23.12,41.78 32.01,46.86 37.09,46.86 47.25,39.24 51.06,34.16 47.88,28.7 46.11,20.19 44.71,13.08 45.22,8.26 46.49,5.72 45.09,2.16 33.91,2.92 21.98,10.67 31.5,14.61 35.44,11.3 39.76,14.61 53.35,28.58 32.01,22.1 26.17,20.19 23.37,25.53 20.07,15.37 20.45,29.85 23.76,35.94 30.99,32.77 35.82,32.64 50.68,44.7 44.46,48.13
  pour Bottom: 14.23,53.21 14.23,-2.67 59.95,-2.67 59.95,53.21
  pour Top: 14.23,53.21 14.23,-2.67 59.95,-2.67 59.95,53.21
LASER  (via drill 0.35)
  Top 0.152: v49.79,40.51 49.79,42.95 49.18,43.56 49.18,45.85 U$31.P$1 | v47.05,35.18 47.05,27.86 46.97,27.79 46.97,27.03 46.13,26.19 44.84,26.19 43.77,25.12 41.48,25.12 41.18,24.82 41.18,23.98 v42.63,22.53
  Bottom 0.152: v49.79,40.51 49.79,37.92 v47.05,35.18 | v42.63,22.53 43.08,22.07 43.08,20.63 42.63,20.17 42.09,20.17 U2.14
LED_1  (via drill 0.35)
  Top 0.152: v46.82,21.77 U$28.P$1
  Bottom 0.152: v46.82,21.77 46.82,22.91 46.67,23.06 U2.21
LED_2  (via drill 0.35)
  Top 0.152: v48.8,24.44 48.8,24.05 51.51,21.34 51.82,21.34 51.95,21.21 51.95,19.89 51.85,19.79 50.55,19.79 48.72,17.96 48.04,17.96 U$63.P$1
  Bottom 0.152: v48.8,24.44 48.19,24.44 47.5,23.75 47.5,23.14 U2.22
LED_3  (via drill 0.35)
  Top 0.152: U$64.P$1 47.48,15.78 47.48,16.63 47.25,16.86 47.25,18.23 47.66,18.64 48.42,18.64 v49.05,19.27
  Bottom 0.152: 50.48,19.33 U2.28 49.1,19.32 v49.05,19.27
LED_4  (via drill 0.35)
  Top 0.152: v48.88,16.13 48.88,14.76 48.04,13.92 48.04,12.85 U$65.P$1
  Bottom 0.152: v48.88,16.13 48.88,17.58 49.79,18.49 50.4,18.49 U2.29
LED_5  (via drill 0.35)
  Top 0.152: v49.48,11.79 48.04,10.34 U$66.P$1
  Bottom 0.152: v49.48,11.79 49.48,12.24 51.39,14.15 51.39,14.22 52.99,15.82 53.22,15.82 53.91,16.51 53.91,18.72 53.3,19.33 52.15,19.33 51.47,18.64 51.47,18.19 51.01,17.73 50.48,17.73 U2.30
N$1
  Bottom 0.152: U$4.P$1 40.65,29.92 44.46,33.73 45.98,33.73 U$20.P$2
N$2
  Top 0.152: U$10.P$1 39.35,34.72 41.26,34.72 42.78,36.25 43.54,36.25 44.38,37.08 U$5.P$2
N$3
  Top 0.152: U$5.P$5 41.86,31.06 41.79,30.99 41.79,29.08 U$8.P$2 41.71,29.01 40.42,27.71 40.34,27.71 U$19.P$3 40.27,27.71 38.89,29.08 U$7.P$2 38.82,29.16 37.52,30.46 37.52,30.91 U$1.P$2 37.45,30.99 36.23,30.99 36.15,31.06 U$11.P$2
N$4
  Top 0.152: U$8.P$1 43.69,29.01 43.47,29.01 41.86,27.41 U$14.P$1
N$5
  Top 0.152: U$5.P$3 43.16,37.08 42.32,36.25 39.5,36.25 39.35,36.4 U$10.P$2 39.35,36.47 39.27,36.55 37.52,36.55 U$6.P$1 37.45,36.63 35.77,36.63 35.31,37.08 34.78,37.08 34.09,36.4 34.09,31.14 U$50.P$1
  Bottom 1.016: U$3.P$2 33.48,30.56 U$50.P$1
N$6
  Top 0.152: U$5.P$1 45.67,37.16 45.67,39.68 45.22,40.13 45.22,41.2 44.53,41.89 39.66,41.89 38.44,40.67 U$2.P$1
  Top 1.016: U$50.P$2 37.18,41.28 U$2.P$1
N$7
  Top 0.152: U$9.P$2 40.11,32.44 41.86,32.44 43.16,31.14 U$5.P$6
N$8
  Top 0.152: U$9.P$1 38.82,31.98 38.82,31.22 U$7.P$1
N$9
  Bottom 0.152: U$22.P$2 47.2,33.73 47.05,33.73 45.83,32.51 45.37,32.51 44.38,31.52 44.38,29.16 U$15.P$1
N$11
  Top 0.152: U$12.P$2 44.23,40.36 44.23,39.45 41.94,37.16 U$5.P$4
N$12
  Top 0.152: LED6.A 51.92,40.67 51.92,42.04 51.47,42.49 R2.1
N$13
  Bottom 0.305: 36.41,36.54 U$16.S 35.31,37.42 U$23.P$2 | U$27.P$2 40.65,36.58 U$4.P$4
  Bottom 1.016: U$27.P$2 37.56,36.54 36.41,36.54
N$14  (via drill 0.35)
  Top 0.305: v38.36,35.43 36.07,35.43 v35.06,36.45
  Bottom 0.305: U$24.P$2 U$23.P$1 33.53,36.7 U$16.G 34.05,36.45 v35.06,36.45 | U$4.P$3 38.39,35.41 v38.36,35.43
N$15  (via drill 0.35)
  Top 0.152: S1.4 49.64,32.13 49.64,36.17 S1.3 49.56,36.25 48.65,37.16 v47.12,37.16
  Bottom 0.152: 42.86,37.08 42.86,35.64 43.01,35.48 U$15.P$3 | 42.86,37.08 42.86,37.85 U$25.P$1 | 42.86,37.08 47.05,37.08 v47.12,37.16
N$16  (via drill 0.35)
  Top 0.152: v47.81,46.76 43.85,46.76 v43.24,46.15
  Bottom 0.152: v47.81,46.76 47.81,44.7 44.61,41.5 44.61,37.85 U$25.P$2 | v43.24,46.15 43.24,45.47 U$26.P$2
  Bottom 0.305: U$17.G 41.53,45.34 U$26.P$2
N$17
  Top 0.152: R2.2 R1.1
N$18
  Bottom 0.305: U$17.DDD U$17.DDDD | U$17.D 41.79,47.12 41.79,46.55 U$17.DD
  Bottom 1.016: CN4.2 38.72,47.3 U$17.DDDD | U$17.DDDD 38.91,46.42 41.41,46.42 41.06,46.77 U$17.D 39.63,47.12 | U$17.DDDD 39.63,47.12 | D1.A 44.66,44.25 40.78,44.25 40.4,44.63 40.4,46.35 39.63,47.12
N$19
  Top 0.152: S1.2 51.77,32.13 51.77,36.17 S1.1 51.7,36.25 51.7,37.69 48.95,40.44 48.95,42.49 R1.2 48.88,42.57 44.91,42.57 44.23,43.26 35.46,43.26 34.55,44.17 D1.C
  Bottom 0.152: U$15.P$4 44.38,35.48 46.36,35.48 48.88,38 48.88,42.49 R1.2
  Bottom 1.016: CN5.2 CN5.1 28.43,39.79 U$18.P$2 30.99,40.68 32.88,42.56 32.92,42.56 D1.C 34.55,47.22 CN4.1
N$20
  Bottom 0.813: U$16.DD U$16.D | U$16.DD 33.69,35.14 | U$16.DDDD U$16.DDD 36.29,35.24 34.04,35.24 U$16.DD
  Bottom 1.016: 33.69,35.14 U$18.P$1 | U$16.D U$16.DDDD
N$21
  Bottom 0.305: LASER.2 45.64,47.35 Q1.3
N$22  (via drill 0.35)
  Top 0.152: v48.11,47.68 49.1,47.68 U$31.P$2
  Bottom 0.152: 48.11,47.75 48.95,47.75 49.1,47.6 U$30.P$1 | 48.11,47.75 47.12,47.75 Q1.1 | 48.11,47.75 v48.11,47.68
N$23
  Top 0.152: U$63.P$2 49.79,17.88 51.16,17.88 LED2.A
N$24
  Top 0.152: U$13.P$1 41.71,26.04 40.34,26.04 40.27,26.11 U$19.P$2 40.19,26.19 39.5,26.87 37.29,26.87 U$19.P$1
N$25
  Top 0.152: U$28.P$2 49.79,20.55 51.16,20.55 LED1.A
N$28
  Top 0.152: LED3.A U$64.P$2
N$30
  Top 0.152: U$65.P$2 49.79,12.85 51.16,12.85 LED4.A
N$32
  Top 0.152: U$66.P$2 49.79,10.26 51.16,10.26 LED5.A
N$46
  Bottom 0.152: U$54.P$2 52.69,16.97 50.48,16.97 U2.31
N$47
  Bottom 0.152: 42.08,12.38 42.17,12.3 | U$60.P$1 42.43,10.67 42.17,10.93 42.17,12.3 | U$59.P$1 40.8,12.3 42.17,12.3 | 42.17,12.3 47.54,12.3
  Bottom 0.2: U2.2 47.96,14.45 47.96,12.71 47.54,12.3
N$48
  Bottom 0.2: U$59.P$2 36.81,12.38 38.15,13.72 47.01,13.72 47.16,13.87 47.16,14.45 U2.3 47.43,13.25 U$61.P$1
NRST  (via drill 0.35)
  Top 0.152: v48.19,16.74 51.24,16.74 52,15.98 v52,13.92 | S2.2 50.02,8.51 50.02,4.47 S2.1 49.94,4.39 44,4.39 43.47,3.86 SV2.5 | v32.14,7.62 30.11,9.65 24.3,9.65 23.61,10.34 23.61,18.7 X4.4
  Bottom 0.152: U$53.P$1 48.27,10.72 50.17,10.72 U$58.P$1 50.17,10.8 51.66,12.28 | v48.19,16.74 48.19,16.43 47.5,15.75 47.05,15.75 46.67,15.37 46.67,14.76 U2.4 | v52,13.92 52,12.62 51.66,12.28 | 51.66,12.28 52.76,11.18 52.76,10.19 46.44,3.86 43.47,3.86 SV2.5 42.42,2.79 36.96,2.79 v32.14,7.62
RX  (via drill 0.35)
  Top 0.2: v45.26,24.55 41.83,24.55 v41.79,24.51
  Bottom 0.2: U2.20 45.83,23.98 v45.26,24.55 | v41.79,24.51 41.53,24.77 39.12,24.77
  Bottom 0.203: X4.3 31.74,23.1 33.05,24.41 36.68,24.41 37.03,24.77 39.12,24.77
S1  (via drill 0.35)
  Top 0.152: 36.15,17.81 36.15,18.34 U$41.P$2 | 36.15,17.81 36.15,17.2 U$42.P$1 | 36.15,17.81 37.98,17.81 U$21.P$2 37.98,17.73 38.13,17.73 42.09,13.77 42.93,13.77 44.38,15.22 v44.38,16.05
  Bottom 0.152: v44.38,16.05 44.99,15.44 44.99,14.76 U2.6
S01
  Bottom 0.152: X1.2 4.79,23.79 4.21,23.79 2.98,25.02 F1.P$2
S2  (via drill 0.35)
  Top 0.152: v42.55,15.29 42.02,15.29 38.36,18.95 37.98,18.95 U$21.P$3
  Bottom 0.152: U$47.P$1 36.15,17.2 36.15,18.34 U$33.P$2 37.06,18.42 37.6,18.95 37.98,18.95 U$21.P$3 | v42.55,15.29 43.01,15.75 43.77,15.75 44.23,15.29 44.23,14.76 U2.7
S02  (via drill 0.35)
  Top 0.152: v3.83,26.29 4.36,25.76 X1.1
  Bottom 0.152: F2.P$2 2.56,27.56 v3.83,26.29
S3  (via drill 0.35)
  Top 0.152: 36.15,20.32 36.15,21.01 U$34.P$2 | 36.15,20.32 36.15,19.71 U$35.P$1 | 36.15,20.32 37.98,20.32 U$21.P$4 37.98,20.24 38.51,20.24 43.16,15.6 43.16,14.91 v42.63,14.38
  Bottom 0.152: v42.63,14.38 42.93,14.68 43.39,14.68 U2.8
S03  (via drill 0.35)
  Top 0.152: v3.83,28.83 3.83,27.15 3.22,26.54 3.22,21.74 3.48,21.48 X2.4
  Bottom 0.152: F3.P$2 2.56,30.1 v3.83,28.83
S4  (via drill 0.35)
  Top 0.152: v43.39,16.43 38.36,21.46 37.98,21.46 U$21.P$5
  Bottom 0.152: U$38.P$1 36.15,19.71 36.15,21.01 U$37.P$2 37.6,21.08 37.98,21.46 U$21.P$5 | v43.39,16.43 43.08,16.13 42.09,16.13 U2.9
S04  (via drill 0.35)
  Top 0.152: X2.3 6.24,20.45 7.12,21.33 9.02,21.33 9.23,21.54 9.23,22.59 8.63,23.19 8.63,28.19 v9.27,28.83
  Bottom 0.152: v9.27,28.83 10.54,30.1 F4.P$2
S5  (via drill 0.35)
  Top 0.152: 36.15,22.84 36.15,23.52 36.07,23.6 U$44.P$2 | 36.15,22.84 36.15,22.38 U$45.P$1 | 36.15,22.84 37.98,22.84 U$21.P$6 38.28,22.76 39.27,21.77 39.27,21.46 v43.39,17.35
  Bottom 0.152: v43.39,17.35 43.01,16.97 42.09,16.97 U2.10
S05  (via drill 0.35)
  Top 0.152: v9.28,26.34 9.28,22.98 9.84,22.41 v9.84,21.66
  Bottom 0.152: F5.P$2 10.75,27.56 9.92,26.99 v9.28,26.34 | v9.84,21.66 9.5,21.33 8.74,21.33 7.86,20.45 X2.2
S6  (via drill 0.35)
  Top 0.152: v36.68,14.99 36.68,15.6 35.54,16.74 35.54,24.21 35.69,24.36 37.67,24.36 37.98,24.05 U$21.P$7
  Bottom 0.152: U$49.P$1 36.15,22.38 36.15,23.52 36.07,23.6 U$48.P$2 36.15,23.6 37.6,23.6 37.98,23.98 U$21.P$7 | v36.68,14.99 38.44,14.99 41.1,17.65 42.02,17.65 U2.11
S06
  Bottom 0.152: F6.P$2 10.79,21.75 X2.1
SOLE  (via drill 0.35)
  Top 0.152: v46.82,24.44 46.82,22.84 v43.39,19.41
  Bottom 0.152: 46.82,32.06 47.2,32.06 U$22.P$1 46.82,32.06 | 46.82,32.06 45.98,32.06 U$20.P$1 | v46.82,24.44 46.82,32.06 | v43.39,19.41 42.17,19.41 42.09,19.33 U2.13
SWO  (via drill 0.35)
  Top 0.2: SV2.6 43.44,9.28 46.33,12.17 46.33,15.85 v46.87,16.38
  Bottom 0.2: v46.87,16.38 46.87,16.77 48.42,18.32 48.42,19.61 49.45,20.65 50.16,20.65 U2.26
TCK  (via drill 0.35)
  Top 0.2: v48.87,21.46 48.87,20.31 48.37,19.81 47.53,19.81 45.35,17.63 45.35,16.12 45.63,15.84 45.63,12.57 39.41,6.35 SV2.2
  Bottom 0.2: U2.24 48.87,22.95 v48.87,21.46
TMS  (via drill 0.35)
  Top 0.2: v45.98,16.64 45.98,12.32 40.9,7.24 SV2.4
  Bottom 0.2: U2.23 47.98,22.87 47.98,18.64 v45.98,16.64
TX
  Bottom 0.203: U2.19 45.03,23.89 43.77,25.15 36.83,25.15 36.45,24.77 32.8,24.77 31.65,23.62 22.69,23.62 X4.2

### Text on the board
tPlace: 12V_IN | ESC | ON | OFF